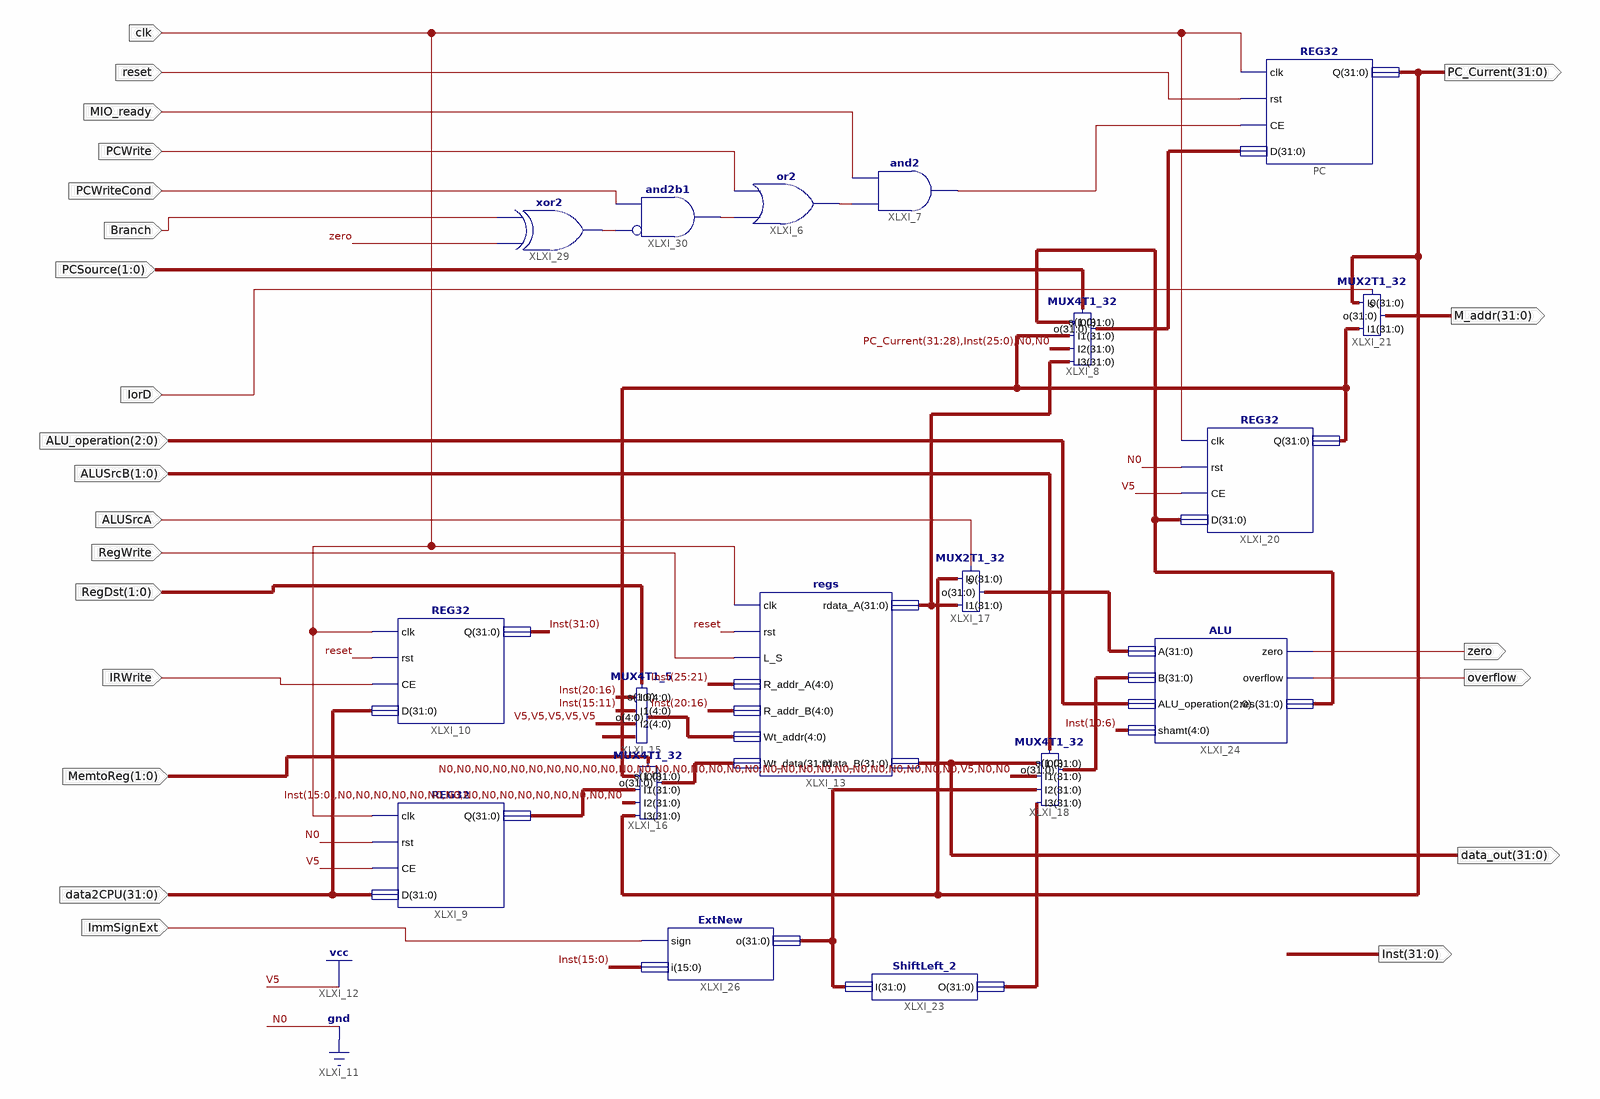
[diagram p0: schematic sheet 1]
// Xilinx ISE schematic M_datapath.sch (kintex7) as structural Verilog: 18 symbols, 23 ports
module M_datapath (
  input  clk,
  input  reset,
  input  MIO_ready,
  input  PCWrite,
  input  PCWriteCond,
  input  [1:0] PCSource,
  input  IorD,
  input  [2:0] ALU_operation,
  input  [1:0] ALUSrcB,
  input  ALUSrcA,
  input  RegWrite,
  input  [1:0] RegDst,
  input  IRWrite,
  input  [1:0] MemtoReg,
  input  [31:0] data2CPU,
  input  Branch,
  input  ImmSignExt,
  output [31:0] Inst,
  output [31:0] data_out,
  output [31:0] PC_Current,
  output zero,
  output overflow,
  output [31:0] M_addr
);

  wire XLXN_20, XLXN_21, XLXN_22, XLXN_24;
  wire [4:0] XLXN_39, XLXN_93;
  wire [31:0] XLXN_28, XLXN_40, XLXN_47, XLXN_50, XLXN_51, XLXN_59, XLXN_70, XLXN_74, XLXN_88, XLXN_91;

  REG32 PC (.clk(clk), .rst(reset), .CE(XLXN_24), .D(XLXN_28), .Q(PC_Current));
  or XLXI_6 (XLXN_22, XLXN_21, PCWrite);
  and XLXI_7 (XLXN_24, XLXN_22, MIO_ready);
  MUX4T1_32 XLXI_8 (
    .s(PCSource), .I0(XLXN_74), .I1(XLXN_91), .I2({PC_Current[31:28], Inst[25:0], 2'b00}), .I3(XLXN_50),
    .o(XLXN_28));
  REG32 XLXI_9 (.clk(clk), .rst(1'b0), .CE(1'b1), .D(data2CPU), .Q(XLXN_47));
  REG32 XLXI_10 (.clk(clk), .rst(reset), .CE(IRWrite), .D(data2CPU), .Q(Inst));
  regs XLXI_13 (
    .clk(clk), .rst(reset), .L_S(RegWrite), .R_addr_A(Inst[25:21]), .R_addr_B(Inst[20:16]),
    .Wt_addr(XLXN_39), .Wt_data(XLXN_40), .rdata_A(XLXN_50), .rdata_B(data_out));
  MUX4T1_5 XLXI_15 (.s(RegDst), .I1(Inst[15:11]), .I0(Inst[20:16]), .o(XLXN_39), .I2({5{1'b1}}), .I3(XLXN_93));
  MUX4T1_32 XLXI_16 (
    .s(MemtoReg), .I0(XLXN_91), .I1(XLXN_47), .I2({Inst[15:0], {16{1'b0}}}), .I3(PC_Current), .o(XLXN_40));
  MUX2T1_32 XLXI_17 (.s(ALUSrcA), .I0(PC_Current), .I1(XLXN_50), .o(XLXN_51));
  MUX4T1_32 XLXI_18 (
    .s(ALUSrcB), .I0(data_out), .I1(32'b00000000000000000000000000000100), .I2(XLXN_59), .I3(XLXN_88),
    .o(XLXN_70));
  REG32 XLXI_20 (.clk(clk), .rst(1'b0), .CE(1'b1), .D(XLXN_74), .Q(XLXN_91));
  MUX2T1_32 XLXI_21 (.s(IorD), .I0(PC_Current), .I1(XLXN_91), .o(M_addr));
  ShiftLeft_2 XLXI_23 (.I(XLXN_59), .O(XLXN_88));
  ALU XLXI_24 (
    .A(XLXN_51), .B(XLXN_70), .ALU_operation(ALU_operation), .zero(zero), .overflow(overflow), .res(XLXN_74),
    .shamt(Inst[10:6]));
  ExtNew XLXI_26 (.sign(ImmSignExt), .i(Inst[15:0]), .o(XLXN_59));
  xor XLXI_29 (XLXN_20, zero, Branch);
  and XLXI_30 (XLXN_21, ~XLXN_20, PCWriteCond);  // and2b1
endmodule
